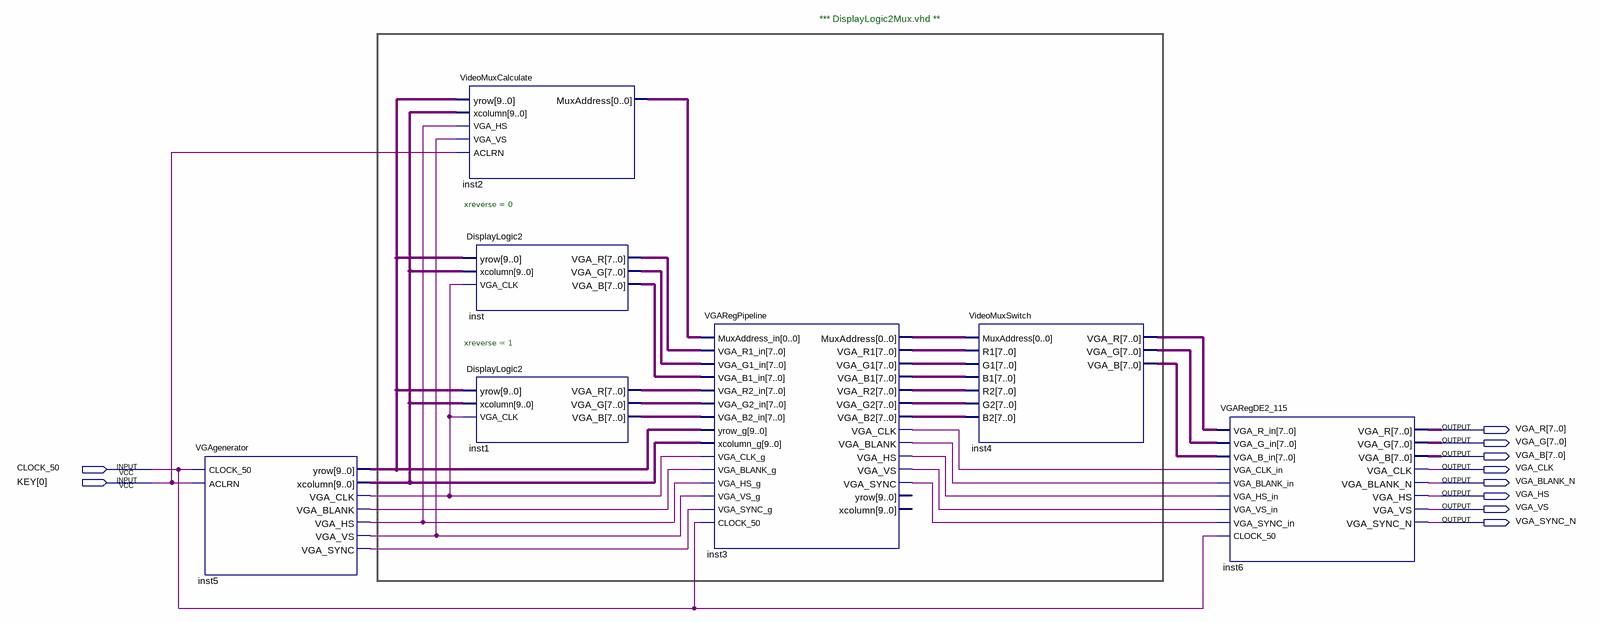
[diagram p0: schematic sheet]
// Quartus schematic DemoMux_OverviewInBDF.bdf as structural Verilog: 7 symbols, 10 pins
module DemoMux_OverviewInBDF (
  input  CLOCK_50,
  input  [0:0] KEY,
  output [7:0] VGA_R,
  output [7:0] VGA_G,
  output [7:0] VGA_B,
  output VGA_CLK,
  output VGA_BLANK_N,
  output VGA_HS,
  output VGA_VS,
  output VGA_SYNC_N
);

  wire inst2_muxaddress, inst3_muxaddress, inst3_vga_blank, inst3_vga_clk, inst3_vga_hs, inst3_vga_sync,
       inst3_vga_vs, inst5_vga_blank, inst5_vga_clk, inst5_vga_hs, inst5_vga_sync, inst5_vga_vs;
  wire [7:0] inst1_vga_b, inst1_vga_g, inst1_vga_r, inst3_vga_b1, inst3_vga_b2, inst3_vga_g1, inst3_vga_g2,
       inst3_vga_r1, inst3_vga_r2, inst4_vga_b, inst4_vga_g, inst4_vga_r, inst_vga_b, inst_vga_g, inst_vga_r;
  wire [9:0] inst5_xcolumn, inst5_yrow;

  VGAgenerator inst5 (
    .CLOCK_50(CLOCK_50), .ACLRN(KEY[0]), .yrow(inst5_yrow), .xcolumn(inst5_xcolumn), .VGA_CLK(inst5_vga_clk),
    .VGA_BLANK(inst5_vga_blank), .VGA_HS(inst5_vga_hs), .VGA_VS(inst5_vga_vs), .VGA_SYNC(inst5_vga_sync));
  VideoMuxCalculate inst2 (
    .yrow(inst5_yrow), .xcolumn(inst5_xcolumn), .VGA_HS(inst5_vga_hs), .VGA_VS(inst5_vga_vs), .ACLRN(KEY[0]),
    .MuxAddress(inst2_muxaddress));
  DisplayLogic2 #(.xreverse(0)) inst (
    .yrow(inst5_yrow), .xcolumn(inst5_xcolumn), .VGA_CLK(inst5_vga_clk), .VGA_R(inst_vga_r),
    .VGA_G(inst_vga_g), .VGA_B(inst_vga_b));
  DisplayLogic2 #(.xreverse(1)) inst1 (
    .yrow(inst5_yrow), .xcolumn(inst5_xcolumn), .VGA_CLK(inst5_vga_clk), .VGA_R(inst1_vga_r),
    .VGA_G(inst1_vga_g), .VGA_B(inst1_vga_b));
  VGARegPipeline inst3 (
    .MuxAddress_in(inst2_muxaddress), .VGA_R1_in(inst_vga_r), .VGA_G1_in(inst_vga_g), .VGA_B1_in(inst_vga_b),
    .VGA_R2_in(inst1_vga_r), .VGA_G2_in(inst1_vga_g), .VGA_B2_in(inst1_vga_b), .yrow_g(inst5_yrow),
    .xcolumn_g(inst5_xcolumn), .VGA_CLK_g(inst5_vga_clk), .VGA_BLANK_g(inst5_vga_blank),
    .VGA_HS_g(inst5_vga_hs), .VGA_VS_g(inst5_vga_vs), .VGA_SYNC_g(inst5_vga_sync), .CLOCK_50(CLOCK_50),
    .MuxAddress(inst3_muxaddress), .VGA_R1(inst3_vga_r1), .VGA_G1(inst3_vga_g1), .VGA_B1(inst3_vga_b1),
    .VGA_R2(inst3_vga_r2), .VGA_G2(inst3_vga_g2), .VGA_B2(inst3_vga_b2), .VGA_CLK(inst3_vga_clk),
    .VGA_BLANK(inst3_vga_blank), .VGA_HS(inst3_vga_hs), .VGA_VS(inst3_vga_vs), .VGA_SYNC(inst3_vga_sync));  // open: yrow, xcolumn
  VideoMuxSwitch inst4 (
    .MuxAddress(inst3_muxaddress), .R1(inst3_vga_r1), .G1(inst3_vga_g1), .B1(inst3_vga_b1),
    .R2(inst3_vga_r2), .G2(inst3_vga_g2), .B2(inst3_vga_b2), .VGA_R(inst4_vga_r), .VGA_G(inst4_vga_g),
    .VGA_B(inst4_vga_b));
  VGARegDE2_115 inst6 (
    .VGA_R_in(inst4_vga_r), .VGA_G_in(inst4_vga_g), .VGA_B_in(inst4_vga_b), .VGA_CLK_in(inst3_vga_clk),
    .VGA_BLANK_in(inst3_vga_blank), .VGA_HS_in(inst3_vga_hs), .VGA_VS_in(inst3_vga_vs),
    .VGA_SYNC_in(inst3_vga_sync), .CLOCK_50(CLOCK_50), .VGA_R(VGA_R), .VGA_G(VGA_G), .VGA_B(VGA_B),
    .VGA_CLK(VGA_CLK), .VGA_BLANK_N(VGA_BLANK_N), .VGA_HS(VGA_HS), .VGA_VS(VGA_VS), .VGA_SYNC_N(VGA_SYNC_N));

  // Notes on the sheet:
  //   *** DisplayLogic2Mux.vhd **
endmodule
